# EAGLE design teensyBoard_revC (EAGLE 9.1.1)
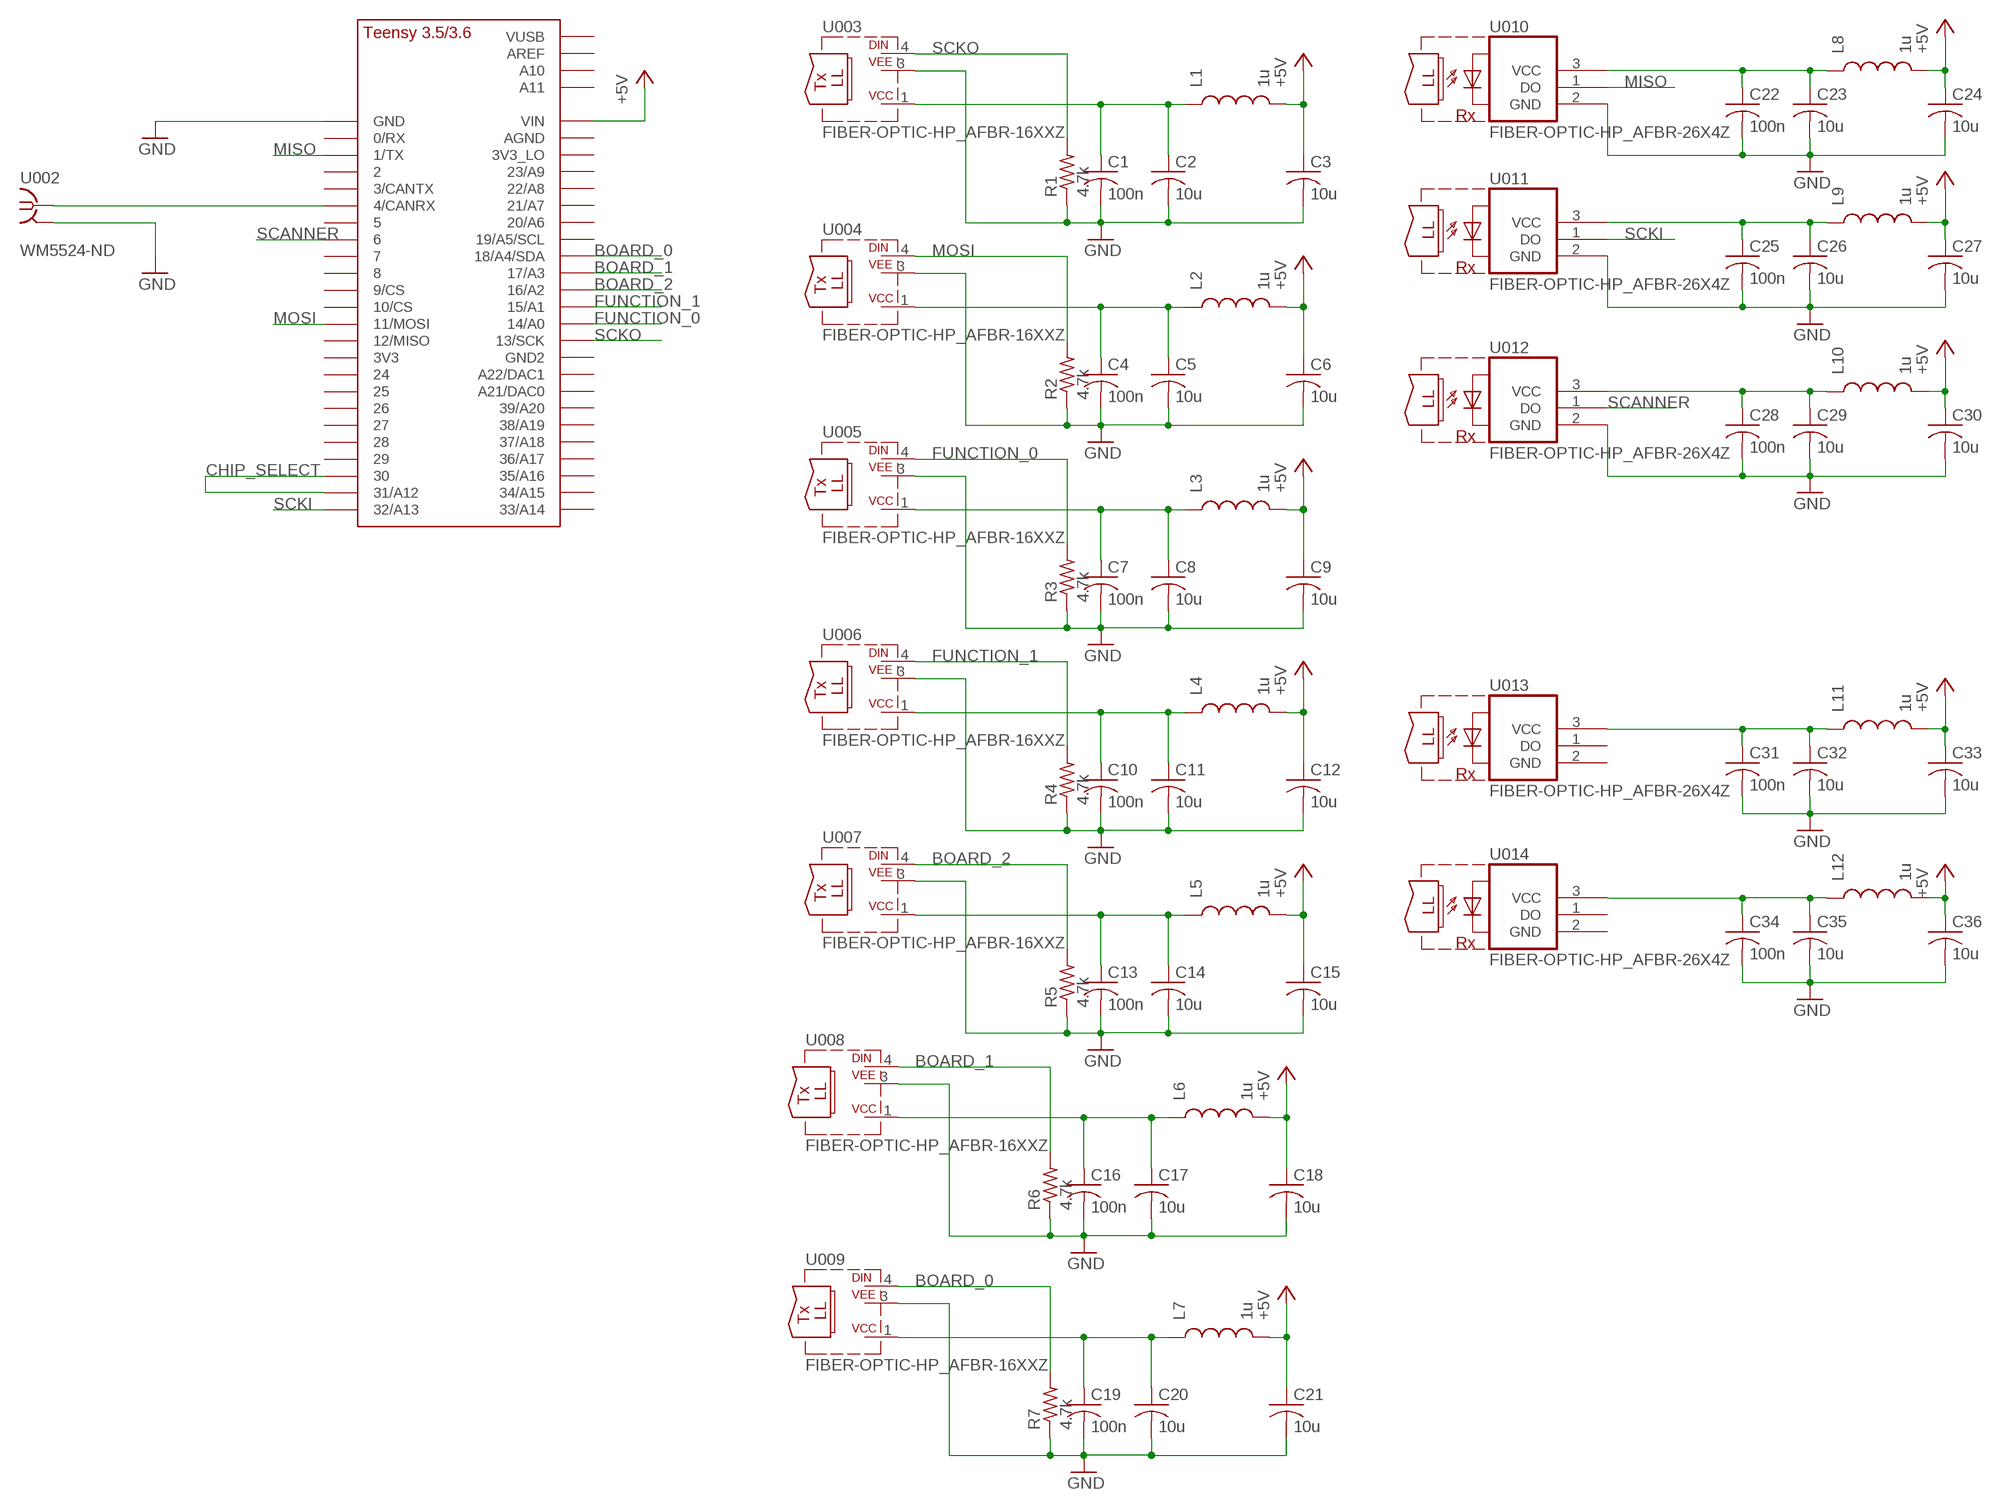
[diagram p0: schematic, sheet 1]

## Parts
C1  100n  C-USC0805  [C0805]
C2  10u  C-USC1206  [C1206]
C3  10u  C-USC1206  [C1206]
C4  100n  C-USC0805  [C0805]
C5  10u  C-USC1206  [C1206]
C6  10u  C-USC1206  [C1206]
C7  100n  C-USC0805  [C0805]
C8  10u  C-USC1206  [C1206]
C9  10u  C-USC1206  [C1206]
C10  100n  C-USC0805  [C0805]
C11  10u  C-USC1206  [C1206]
C12  10u  C-USC1206  [C1206]
C13  100n  C-USC0805  [C0805]
C14  10u  C-USC1206  [C1206]
C15  10u  C-USC1206  [C1206]
C16  100n  C-USC0805  [C0805]
C17  10u  C-USC1206  [C1206]
C18  10u  C-USC1206  [C1206]
C19  100n  C-USC0805  [C0805]
C20  10u  C-USC1206  [C1206]
C21  10u  C-USC1206  [C1206]
C22  100n  C-USC0805  [C0805]
C23  10u  C-USC1206  [C1206]
C24  10u  C-USC1206  [C1206]
C25  100n  C-USC0805  [C0805]
C26  10u  C-USC1206  [C1206]
C27  10u  C-USC1206  [C1206]
C28  100n  C-USC0805  [C0805]
C29  10u  C-USC1206  [C1206]
C30  10u  C-USC1206  [C1206]
C31  100n  C-USC0805  [C0805]
C32  10u  C-USC1206  [C1206]
C33  10u  C-USC1206  [C1206]
C34  100n  C-USC0805  [C0805]
C35  10u  C-USC1206  [C1206]
C36  10u  C-USC1206  [C1206]
L1  1u  INDUCTOR0805  [0805]
L2  1u  INDUCTOR0805  [0805]
L3  1u  INDUCTOR0805  [0805]
L4  1u  INDUCTOR0805  [0805]
L5  1u  INDUCTOR0805  [0805]
L6  1u  INDUCTOR0805  [0805]
L7  1u  INDUCTOR0805  [0805]
L8  1u  INDUCTOR0805  [0805]
L9  1u  INDUCTOR0805  [0805]
L10  1u  INDUCTOR0805  [0805]
L11  1u  INDUCTOR0805  [0805]
L12  1u  INDUCTOR0805  [0805]
R1  4.7k  R-US_M0805  [M0805]
R2  4.7k  R-US_M0805  [M0805]
R3  4.7k  R-US_M0805  [M0805]
R4  4.7k  R-US_M0805  [M0805]
R5  4.7k  R-US_M0805  [M0805]
R6  4.7k  R-US_M0805  [M0805]
R7  4.7k  R-US_M0805  [M0805]
U001  TEENSY_3.5/3.6_BASIC  [TEENSY_3.5/3.6_BASIC]
U002  WM5524-ND  [WM5524-ND]
U003  FIBER-OPTIC-HP_AFBR-16XXZ  [FIBER-OPTIC-HP_HFBR-15X3]
U004  FIBER-OPTIC-HP_AFBR-16XXZ  [FIBER-OPTIC-HP_HFBR-15X3]
U005  FIBER-OPTIC-HP_AFBR-16XXZ  [FIBER-OPTIC-HP_HFBR-15X3]
U006  FIBER-OPTIC-HP_AFBR-16XXZ  [FIBER-OPTIC-HP_HFBR-15X3]
U007  FIBER-OPTIC-HP_AFBR-16XXZ  [FIBER-OPTIC-HP_HFBR-15X3]
U008  FIBER-OPTIC-HP_AFBR-16XXZ  [FIBER-OPTIC-HP_HFBR-15X3]
U009  FIBER-OPTIC-HP_AFBR-16XXZ  [FIBER-OPTIC-HP_HFBR-15X3]
U010  FIBER-OPTIC-HP_AFBR-26X4Z  [FIBER-OPTIC-HP_HFBR-15X3]
U011  FIBER-OPTIC-HP_AFBR-26X4Z  [FIBER-OPTIC-HP_HFBR-15X3]
U012  FIBER-OPTIC-HP_AFBR-26X4Z  [FIBER-OPTIC-HP_HFBR-15X3]
U013  FIBER-OPTIC-HP_AFBR-26X4Z  [FIBER-OPTIC-HP_HFBR-15X3]
U014  FIBER-OPTIC-HP_AFBR-26X4Z  [FIBER-OPTIC-HP_HFBR-15X3]

## Nets
+5V: C3.1 C6.1 C9.1 C12.1 C15.1 C18.1 C21.1 C24.1 C27.1 C30.1 C33.1 C36.1 L1.2 L2.2 L3.2 L4.2 L5.2 L6.2 L7.2 L8.2 L9.2 L10.2 L11.2 L12.2 U001.VIN
BOARD_0: R7.2 U001.18/A4/SDA U009.4(DIN)
BOARD_1: R6.2 U001.17/A3 U008.4(DIN)
BOARD_2: R5.2 U001.16/A2 U007.4(DIN)
CHIP_SELECT: U001.30 U001.31/A12
FUNCTION_0: R3.2 U001.14/A0 U005.4(DIN)
FUNCTION_1: R4.2 U001.15/A1 U006.4(DIN)
GND: C1.2 C2.2 C3.2 C4.2 C5.2 C6.2 C7.2 C8.2 C9.2 C10.2 C11.2 C12.2 C13.2 C14.2 C15.2 C16.2 C17.2 C18.2 C19.2 C20.2 C21.2 C22.2 C23.2 C24.2 C25.2 C26.2 C27.2 C28.2 C29.2 C30.2 C31.2 C32.2 C33.2 C34.2 C35.2 C36.2 R1.1 R2.1 R3.1 R4.1 R5.1 R6.1 R7.1 U001.GND U002.2(GND) U002.3(GND) U003.3(VEE) U004.3(VEE) U005.3(VEE) U006.3(VEE) U007.3(VEE) U008.3(VEE) U009.3(VEE) U010.2(GND) U011.2(GND) U012.2(GND)
MISO: U001.1/TX U010.1(DO)
MOSI: R2.2 U001.11/MOSI U004.4(DIN)
N$1: C22.1 C23.1 L8.1 U010.3(VCC)
N$2: C25.1 C26.1 L9.1 U011.3(VCC)
N$3: U001.4/CANRX U002.1
N$5: C1.1 C2.1 L1.1 U003.1(VCC)
N$6: C31.1 C32.1 L11.1 U013.3(VCC)
N$7: C34.1 C35.1 L12.1 U014.3(VCC)
N$9: C4.1 C5.1 L2.1 U004.1(VCC)
N$12: C7.1 C8.1 L3.1 U005.1(VCC)
N$15: C10.1 C11.1 L4.1 U006.1(VCC)
N$18: C13.1 C14.1 L5.1 U007.1(VCC)
N$21: C16.1 C17.1 L6.1 U008.1(VCC)
N$24: C19.1 C20.1 L7.1 U009.1(VCC)
N$31: C28.1 C29.1 L10.1 U012.3(VCC)
SCANNER: U001.6 U012.1(DO)
SCKI: U001.32/A13 U011.1(DO)
SCKO: R1.2 U001.13/SCK U003.4(DIN)
Unconnected: U001.0/RX U001.2 U001.3/CANTX U001.3V3 U001.3V3_LO U001.5 U001.7 U001.8 U001.9/CS U001.10/CS U001.12/MISO U001.19/A5/SCL U001.20/A6 U001.21/A7 U001.21/DAC0(A21/DAC0) U001.22/A8 U001.23/A9 U001.24 U001.25 U001.26 U001.27 U001.28 U001.29 U001.33/A14 U001.34/A15 U001.35/A16 U001.36/A17 U001.37/A18 U001.38/A19 U001.39/A20 U001.A10 U001.A11 U001.A22/DAC1 U001.AGND U001.AREF U001.GND2 U001.VUSB U013.1(DO) U014.1(DO)

## Power pins joined to a net without a drawn wire
GND: U013.2(GND) U014.2(GND)

## Library data of the parts
C1-C36 = resistor:C-US: CAPACITOR, American symbol
L1-L12 = SparkFun-Passives:INDUCTOR: Inductors Basic Inductor/Choke - 0603 and 1206. Footprints are not proven and vary greatly between part numbers.
R1-R7 = resistor:R-US_: RESISTOR, American symbol
U001 = Teensy356:TEENSY_3.5/3.6_BASIC
U002 = con-coax:WM5524-ND
U003-U009 = fiberInterface_revC_V2:FIBER-OPTIC-HP_AFBR-16XXZ
U010-U014 = fiberInterface_revC_V2:FIBER-OPTIC-HP_AFBR-26X4Z

## Board
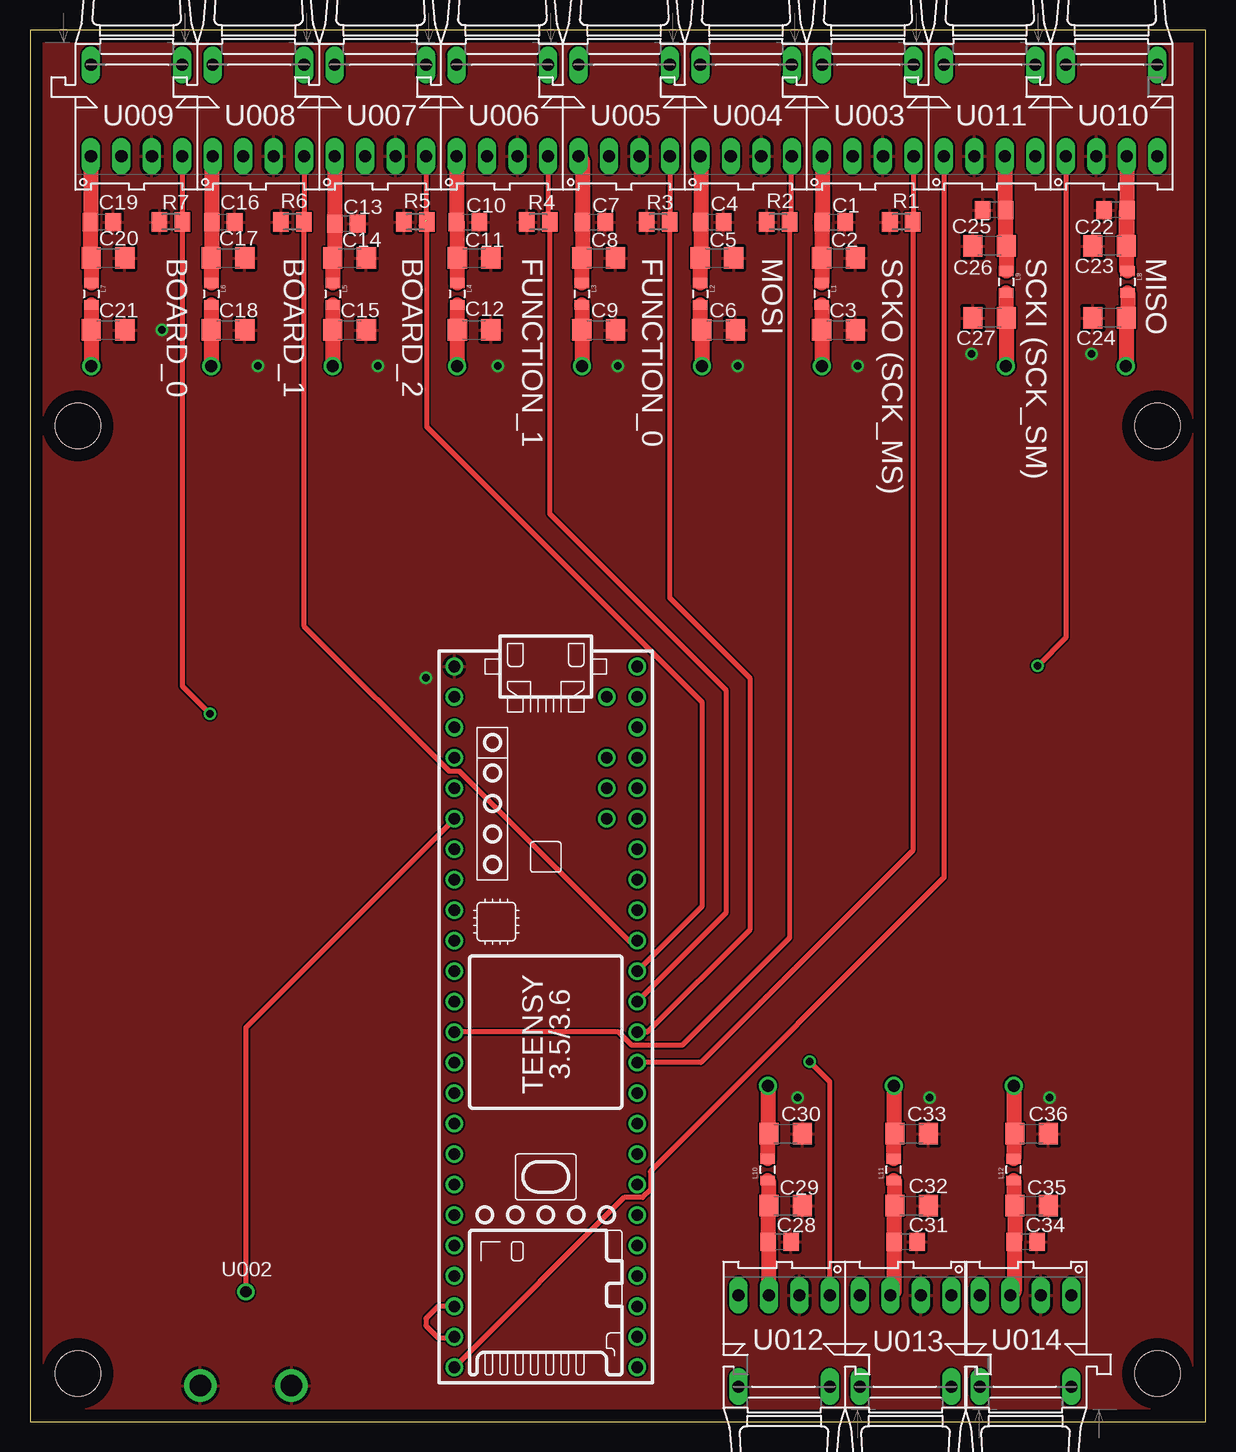
[diagram p1: board, top side]
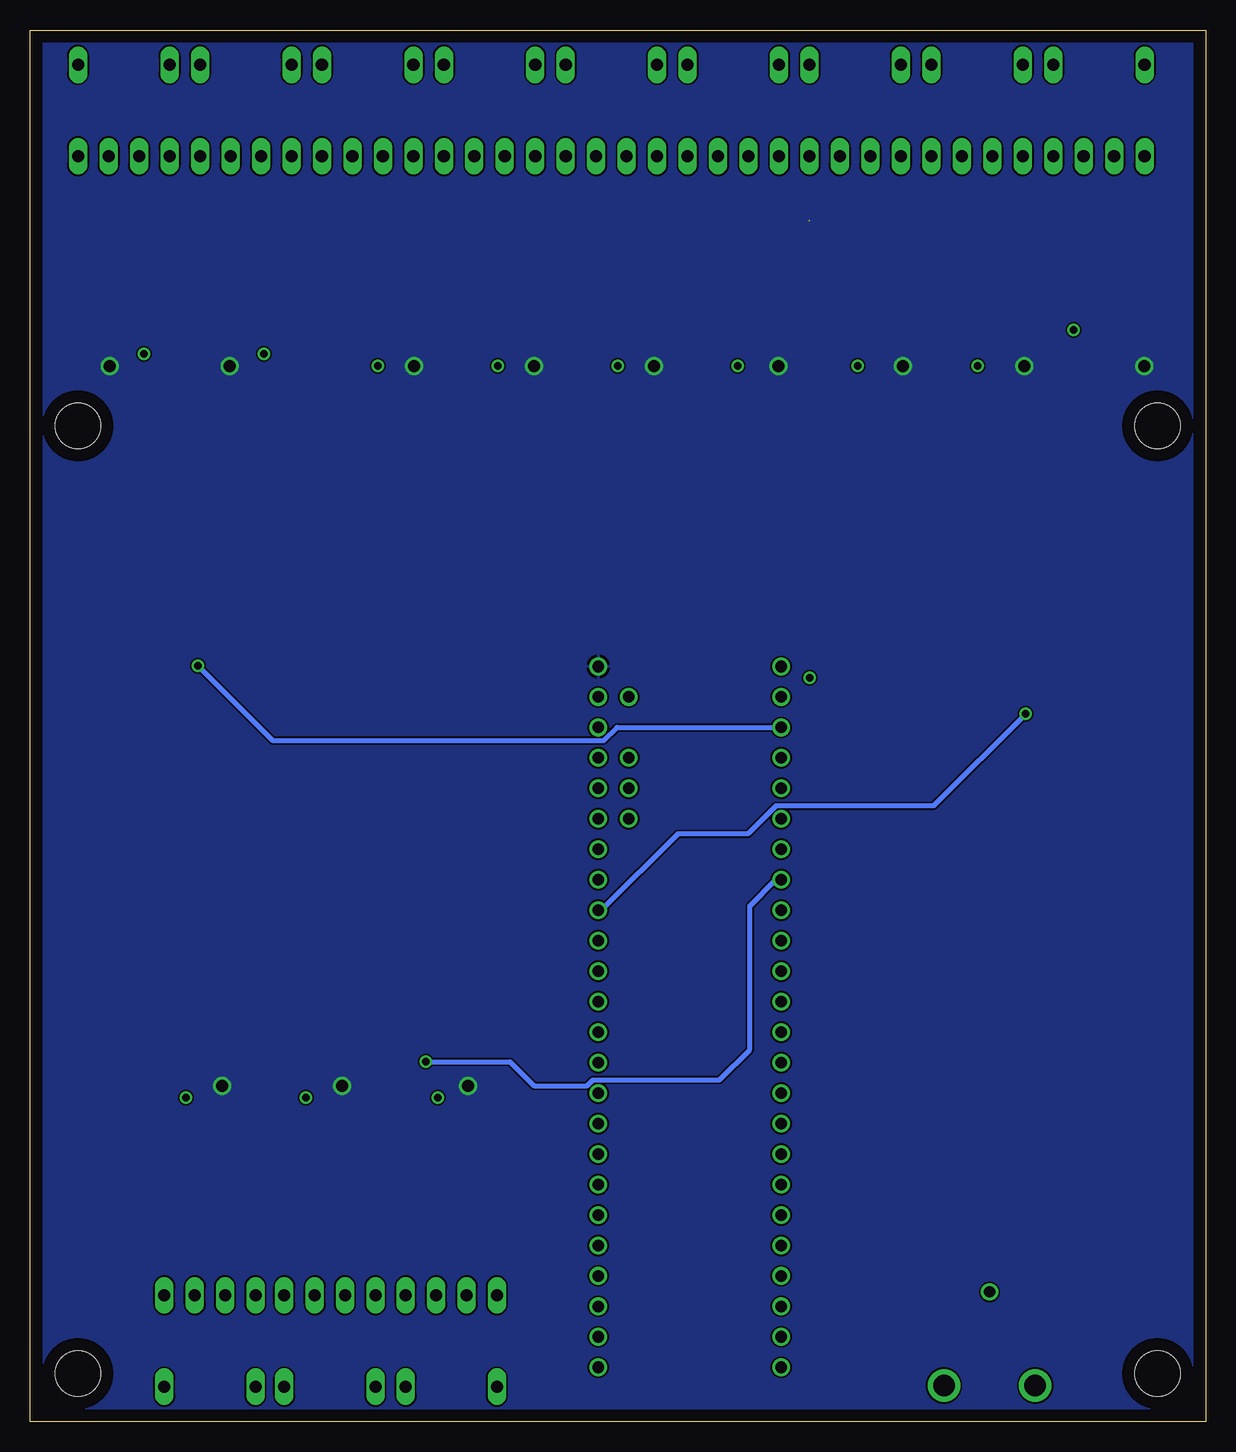
[diagram p2: board, bottom side, seen from below]

Size 98 x 116 mm. Coordinates in mm from the lower left corner, seen from the top.
Outline: 0,0 98,0 98,116 0,116 0,0
Copper layers (1+16): Top 0.035mm / dielectric 0.5mm / Bottom 0.035mm
Design rules "default *": minimum track width 6mil, minimum drill 0.35mm, track to track 6mil, track to pad 6mil, pad to pad 6mil, via to via 6mil, smd to smd 6mil, copper to edge 40mil, drill to drill 6mil, minimum pad ring 10mil, minimum via ring 8mil, stop-mask expansion 4mil, vias tented up to drill 0mil, thermal gap 10mil
Holes 3.81 mm at 4,4 94,4 4,83 94,83

### Footprints (pad centres in the part's own frame; a part is rotated, then mirrored left to right if it is on the bottom)
C0805 = smd 1.3 x 1.5: 1 -0.95,0; 2 0.95,0
C1206 = smd 1.6 x 1.8: 1 -1.4,0; 2 1.4,0
0805 = smd 0.8 x 1.2: 1 -0.9,0; 2 0.9,0
M0805 = smd 1.3 x 1.6: 1 -0.95,0; 2 0.95,0
TEENSY_3.5/3.6_BASIC = drill 0.965: 0/RX -25.4,-7.62; 1/TX -22.86,-7.62; 2 -20.32,-7.62; 3/CANTX -17.78,-7.62; 3V3 7.62,-7.62; 3V3_LO -22.86,7.62; 4/CANRX -15.24,-7.62; 5 -12.7,-7.62; 6 -10.16,-7.62; 7 -7.62,-7.62; 8 -5.08,-7.62; 9/CS -2.54,-7.62; 10/CS 0,-7.62; 11/MOSI 2.54,-7.62; 12/MISO 5.08,-7.62; 13/SCK 5.08,7.62; 14/A0 2.54,7.62; 15/A1 0,7.62; 16/A2 -2.54,7.62; 17/A3 -5.08,7.62; 18/A4/SDA -7.62,7.62; 19/A5/SCL -10.16,7.62; 20/A6 -12.7,7.62; 21/A7 -15.24,7.62; 21/DAC0 12.7,7.62; 22/A8 -17.78,7.62; 23/A9 -20.32,7.62; 24 10.16,-7.62; 25 12.7,-7.62; 26 15.24,-7.62; 27 17.78,-7.62; 28 20.32,-7.62; 29 22.86,-7.62; 30 25.4,-7.62; 31/A12 27.94,-7.62; 32/A13 30.48,-7.62; 33/A14 30.48,7.62; 34/A15 27.94,7.62; 35/A16 25.4,7.62; 36/A17 22.86,7.62; 37/A18 20.32,7.62; 38/A19 17.78,7.62; 39/A20 15.24,7.62; A10 -17.78,5.08; A11 -15.24,5.08; A22/DAC1 10.16,7.62; AGND -25.4,7.62; AREF -20.32,5.08; GND -27.94,-7.62; GND2 7.62,7.62; VIN -27.94,7.62; VUSB -25.4,5.08
WM5524-ND = drill 0.92 pad 1.02: 1 0,7.8 | drill 1.8 pad 1.9: 2 -3.8,0; 3 3.8,0
FIBER-OPTIC-HP_HFBR-15X3 = drill 1.016 long: 1 3.81,9.525; 2 1.27,9.525; 3 -1.27,9.525; 4 -3.81,9.525; 5 -3.81,1.905; 8 3.81,1.905

### Placement (x,y rotation side)
C1  67,100 0 top
C2  67.4,97 0 top
C3  67.4,91 0 top
C4  56.87,100 0 top
C5  57.27,97 0 top
C6  57.4,91 0 top
C7  47,100 0 top
C8  47.4,97 0 top
C9  47.4,91 0 top
C10  36.49,100 0 top
C11  37.02,97 0 top
C12  37.02,91 0 top
C13  26.36,99.87 0 top
C14  26.64,97 0 top
C15  26.64,91 0 top
C16  16.11,100 0 top
C17  16.51,97 0 top
C18  16.51,91 0 top
C19  5.98,100 0 top
C20  6.51,97 0 top
C21  6.51,91 0 top
C22  90.5,101 180 top
C23  90,98 180 top
C24  90,92 180 top
C25  80.37,101 180 top
C26  80,98 180 top
C27  80,92 180 top
C28  62.5,15 0 top
C29  63,18 0 top
C30  63,24 0 top
C31  73,15 0 top
C32  73.5,18 0 top
C33  73.5,24 0 top
C34  83,15 0 top
C35  83.5,18 0 top
C36  83.5,24 0 top
L1  66,94 270 top
L2  55.87,94 270 top
L3  46,94 270 top
L4  35.62,94 270 top
L5  25.24,94 270 top
L6  15.11,94 270 top
L7  5.11,94 270 top
L8  91.5,95 270 top
L9  81.37,95 270 top
L10  61.5,21 90 top
L11  72,21 90 top
L12  82,21 90 top
R1  72.64,100 0 top
R2  62.38,100 0 top
R3  52.38,100 0 top
R4  42.38,100 0 top
R5  32.13,100 0 top
R6  21.87,100 0 top
R7  11.75,100 0 top
U001  43,35 270 top
U002  18,3 0 top
U003  69.85,115 180 top
U004  59.69,115 180 top
U005  49.53,115 180 top
U006  39.37,115 180 top
U007  29.21,115 180 top
U008  19.05,115 180 top
U009  8.89,115 180 top
U010  90.17,115 180 top
U011  80.01,115 180 top
U012  62.87,1 0 top
U013  73,1 0 top
U014  83,1 0 top

### Tracks (layer width: path | path; a pad name or v marks a point on that pad's centre or on a via)
+5V  (via drill 1)
  Top 1.27: L1.2 C3.1 v66,88 | L2.2 55.87,91.13 C6.1 v56,88 | L8.2 91.5,92.1 C24.1 91.4,88.03 v91.36,88 | L9.2 81.37,92.03 C27.1 81.4,88.03 v81.36,88 | L11.2 72,23.9 | 72,23.9 C33.1 | C36.1 82,23.9 | 82,23.9 L12.2 | v72,28 72,23.9 | v82,28 82,23.9 | L10.2 61.5,23.9 | 61.5,23.9 C30.1 | v61.5,28 61.5,23.9 | L3.2 C9.1 v46,88 | L4.2 C12.1 v35.62,88 | L5.2 C15.1 v25.24,88 | L6.2 C18.1 v15.11,88 | L7.2 C21.1 v5.11,88
  pour Bottom: 0,116 0,0 98,0 98,116
BOARD_0  (via drill 0.6)
  Top 0.406: 12.77,61.23 v15,59 12.7,61.3 R7.2 | R7.2 12.83,100.01 12.7,100.14 U009.4 12.7,100.07 12.63,100 R7.2
  Bottom 0.406: v15,59 22.67,51.33 35.83,51.33 38.16,49 44,49 50.38,42.62 U001.18/A4/SDA
BOARD_1
  Top 0.406: U001.17/A3 50.08,40.08 50,40 35.77,54.23 34.93,54.23 22.82,66.33 R6.2 22.86,100.04 U008.4
BOARD_2  (1 unrouted)
  Top 0.406: U001.16/A2 56,42.92 56,60 33.74,82.26 33.08,82.92 R5.2 33.02,100.06 U007.4 | 33.02,100.14 32.58,99.7
CHIP_SELECT
  Top 0.406: U001.30 34,9.6 33,8.6 33,8 34,7 35.32,7 U001.31/A12
FUNCTION_0
  Top 0.406: U001.14/A0 51.46,32.46 60,41 60,62 53.33,68.67 R3.2 U005.4
FUNCTION_1
  Top 0.406: U001.15/A1 58,42.38 58,61 43.33,75.67 R4.2 43.18,100.15 U006.4
GND  (via drill 0.6)
  other vias: 33,62 88.5,89 78.5,89 69,88 59,88 49,88 39,88 29,88 19,88 11,91 85,27 75,27 64,27
  pour Top: 0,116 0,0 98,0 98,116
MISO  (via drill 0.6)
  Top 0.406: U010.1 86.36,65.36 v84,63
  Bottom 0.406: U001.1/TX 49.08,57.86 50.17,56.77 77.77,56.77 v84,63
MOSI
  Top 0.406: U001.11/MOSI 49.08,32.46 50.17,31.37 54.37,31.37 63.33,40.33 R2.2 63.45,100.13 63.45,105.42 U004.4
N$1
  Top 1.27: C22.1 U010.3 C22.1 91.4,100.95 | C23.1 91.4,100.95 | 91.4,100.95 C22.1 | L8.1 91.4,96 C23.1 | C22.1 91.45,98.05 C23.1
N$2
  Top 1.27: U011.3 81.28,101.04 C25.1 81.32,98.08 C26.1 81.4,95.93 L9.1
N$3
  Top 0.406: U001.4/CANRX 18,32.86 U002.1
N$5
  Top 1.27: L1.1 C2.1 66,99.95 C1.1 U003.1
N$6
  Top 1.27: U013.3 72.05,10.85 C31.1 72.05,17.95 C32.1 72.1,20 L11.1
N$7
  Top 1.27: L12.1 82,18.1 C35.1 82.1,15.05 C34.1 82.05,10.85 U014.3
N$9
  Top 1.27: L2.1 C5.1 55.92,97.05 C4.1 55.92,105.43 U004.1
N$12
  Top 1.27: L3.1 C8.1 arc90 46.05,97.05 C7.1 46.05,105.14 U005.1
N$15
  Top 1.27: L4.1 C11.1 35.62,99.92 C10.1 35.54,105.46 U006.1
N$18
  Top 1.27: U007.1 25.41,105.46 C13.1 25.41,97.18 C14.1 L5.1
N$21
  Top 1.27: L6.1 C17.1 15.16,97.05 C16.1 15.16,105.4 U008.1
N$24
  Top 1.27: U009.1 5.08,100.05 C19.1 5.03,97.08 C20.1 L7.1
N$31
  Top 1.27: U012.3 61.6,14.95 C28.1 61.55,17.95 | 61.55,17.95 C29.1 | L10.1 61.55,20.05 61.55,17.95
SCANNER  (via drill 0.6)
  Top 0.406: U012.1 66.68,28.32 v65,30
  Bottom 0.406: v65,30 58,30 56,28 51.55,28 51.07,28.47 40.53,28.47 38,31 38,43 35.84,45.16 U001.6
SCKI
  Top 0.406: U001.32/A13 49.53,18.67 51.07,18.67 51.71,19.31 51.71,20.85 76.2,45.34 U011.1
SCKO
  Top 0.406: U001.13/SCK 55.92,29.92 71.48,45.48 73.58,47.59 R1.2 | R1.2 73.66,100.91 U003.4 73.66,99.89 73.59,99.82 R1.2

### Text on the board
tNames: BOARD_0 | BOARD_1 | BOARD_2 | FUNCTION_1 | FUNCTION_0 | MOSI | SCKO (SCK_MS) | SCKI (SCK_SM) | MISO